# EAGLE design smd_can4vscp_usb_0.0.2 (EAGLE 5.11)
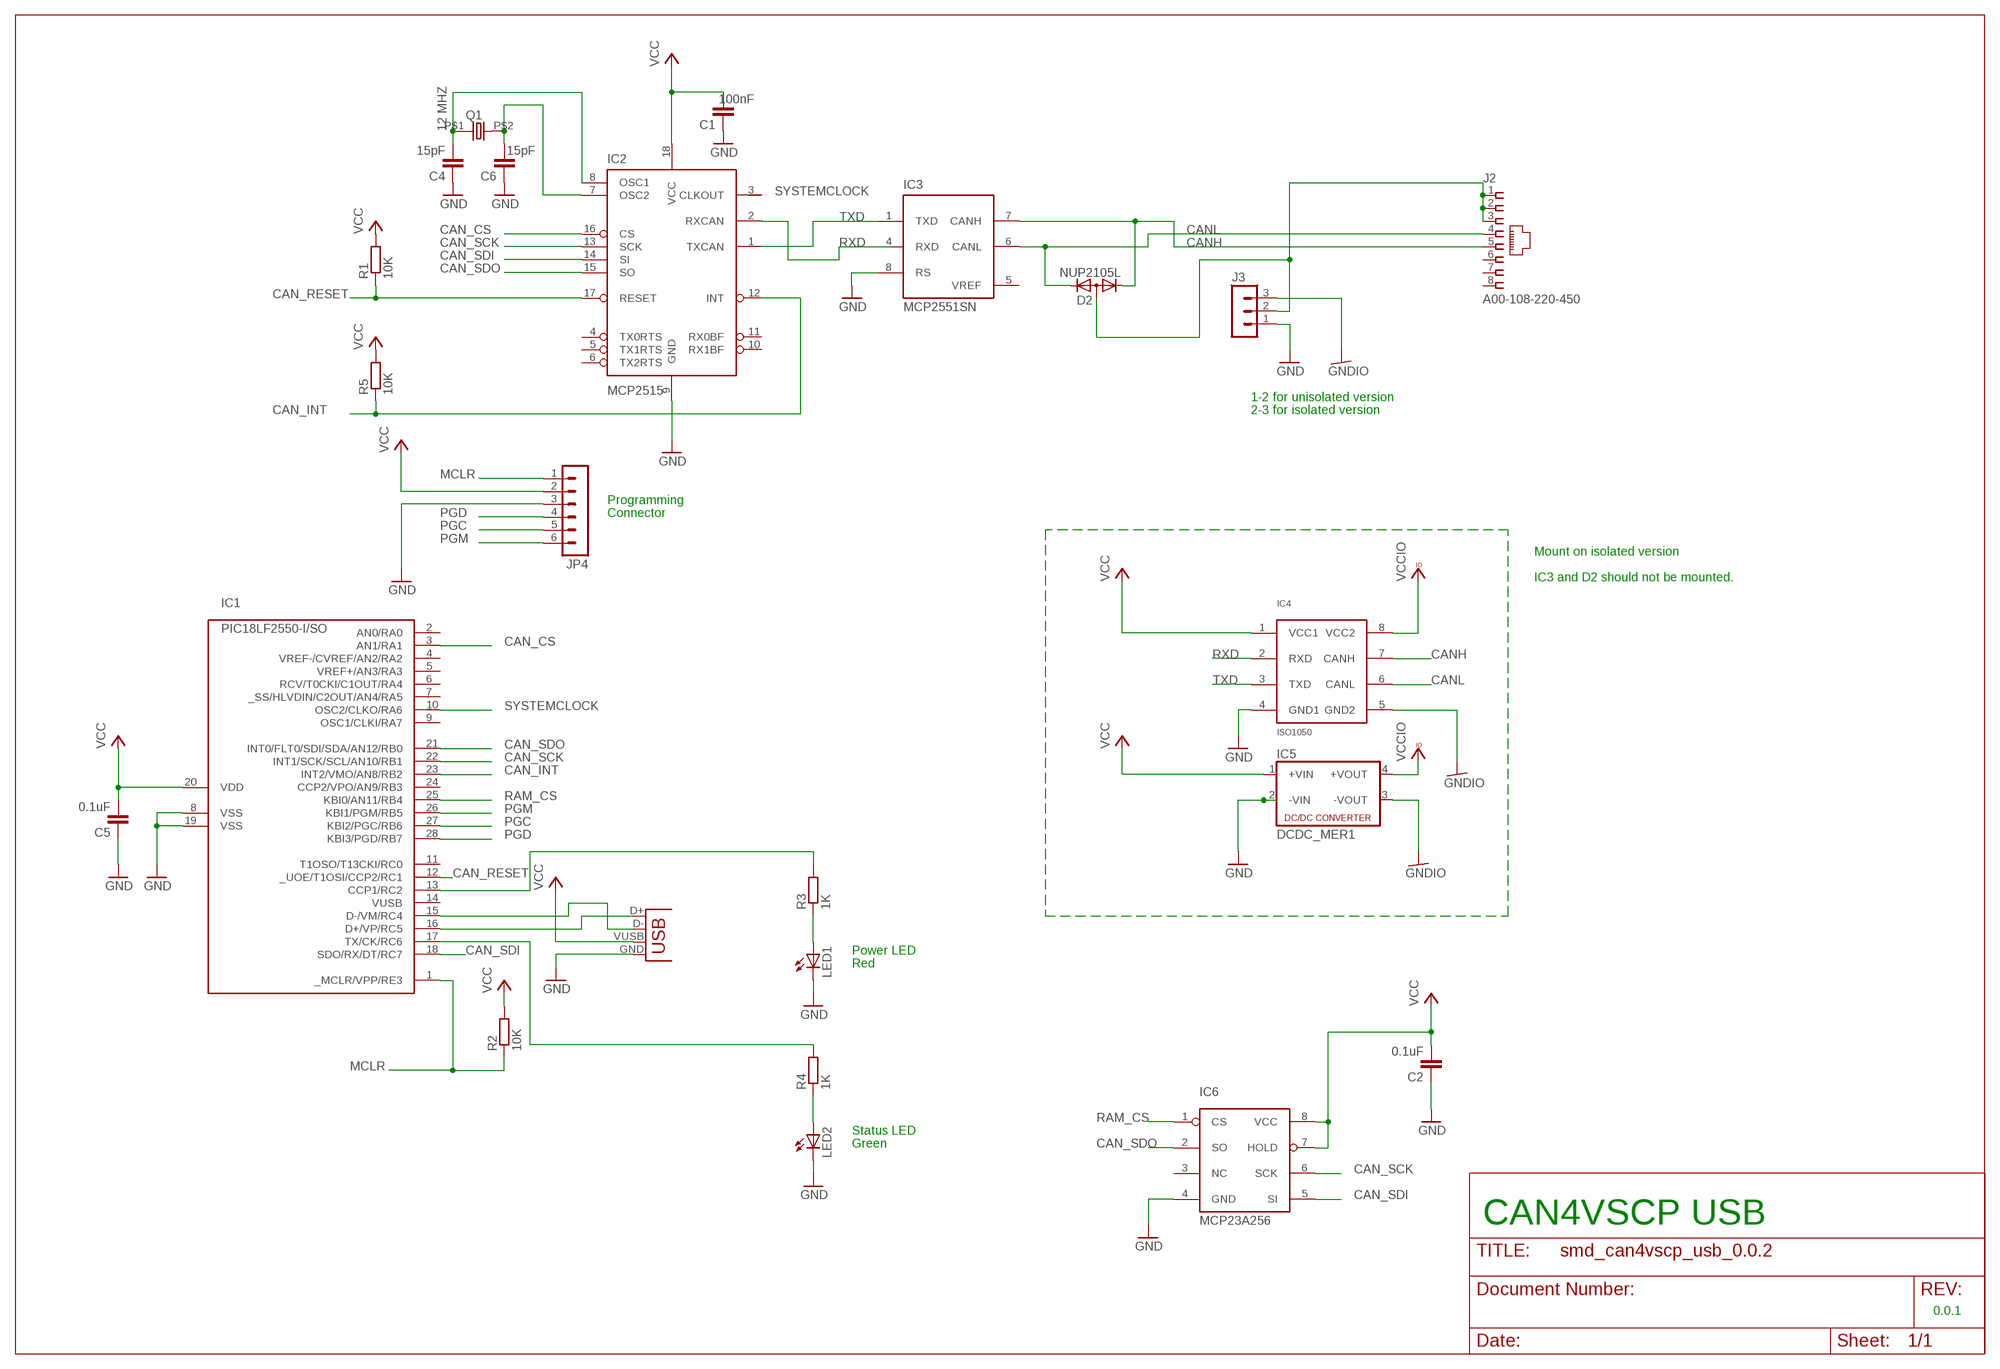
[diagram p0: schematic, sheet 1]

## Parts
C1  100nF  C-EUC0805  [C0805]
C2  0.1uF  C-EUC0805  [C0805]
C4  15pF  C-EUC0805  [C0805]
C5  0.1uF  C-EUC0805  [C0805]
C6  15pF  C-EUC0805  [C0805]
D2  NUP2105L  DIODE-2CA|ACSOT23  [SOT23]
IC1  PIC18LF2550-I/SO  [SO-28W]
IC2  MCP2515  [SO-18W]
IC3  MCP2551SN  [SO-08]
IC4  ISO1050  [DUB_PSOP]
IC5  DCDC_MER1  [MER1]
IC6  MCP23A256  [SO-8]
J2  A00-108-220-450  [RJ-45]
J3  MA03-1  [MA03-1]
J4  USB-B-S  [USB-B-SMT]
JP4  MA06-1  [MA06-1]
LED1  LEDCHIP-LED0805  [CHIP-LED0805]
LED2  LEDCHIP-LED0805  [CHIP-LED0805]
Q1  12 MHZ  HC-49S  [9C]
R1  10K  R-EU_R0805  [R0805]
R2  10K  R-EU_R0805  [R0805]
R3  1K  R-EU_R0805  [R0805]
R4  1K  R-EU_R0805  [R0805]
R5  10K  R-EU_R0805  [R0805]

## Nets
CAN_CS: IC1.3(AN1/RA1) IC2.16(CS)
CAN_INT: IC1.23(INT2/VMO/AN8/RB2) IC2.12(INT) R5.1
CAN_RESET: IC1.12(_UOE/T1OSI/CCP2/RC1) IC2.17(RESET) R1.1
CAN_SCK: IC1.22(INT1/SCK/SCL/AN10/RB1) IC2.13(SCK) IC6.6(SCK)
CAN_SDI: IC1.18(SDO/RX/DT/RC7) IC2.14(SI) IC6.5(SI)
CAN_SDO: IC1.21(INT0/FLT0/SDI/SDA/AN12/RB0) IC2.15(SO) IC6.2(SO)
CANH: D2.1(K1) IC3.7(CANH) IC4.7(CANH) J2.5
CANL: D2.2(K2) IC3.6(CANL) IC4.6(CANL) J2.4
GND: C1.1 C2.1 C4.1 C5.1 C6.1 IC1.8(VSS) IC1.19(VSS) IC2.9(GND) IC3.8(RS) IC4.4(GND1) IC5.2(-VIN) IC6.4(GND) J3.1 J4.GND JP4.3 LED1.C LED2.C
GNDIO: IC4.5(GND2) IC5.3(-VOUT) J3.3
MCLR: IC1.1(_MCLR/VPP/RE3) JP4.1 R2.1
N$1: IC1.16(D+/VP/RC5) J4.D+
N$2: C4.2 IC2.8(OSC1) Q1.P$1
N$3: IC1.15(D-/VM/RC4) J4.D-
N$4: LED2.A R4.1
N$5: LED1.A R3.1
N$6: IC1.13(CCP1/RC2) R3.2
N$7: C6.2 IC2.7(OSC2) Q1.P$2
N$9: D2.3(A) J2.1 J2.2 J2.3 J3.2
N$10: IC1.17(TX/CK/RC6) R4.2
PGC: IC1.27(KBI2/PGC/RB6) JP4.5
PGD: IC1.28(KBI3/PGD/RB7) JP4.4
PGM: IC1.26(KBI1/PGM/RB5) JP4.6
RAM_CS: IC1.25(KBI0/AN11/RB4) IC6.1(CS)
RXD: IC2.2(RXCAN) IC4.2(RXD)
SYSTEMCLOCK: IC1.10(OSC2/CLKO/RA6) IC2.3(CLKOUT)
TXD: IC2.1(TXCAN) IC3.1(TXD) IC4.3(TXD)
VCC: C1.2 C2.2 C5.2 IC1.20(VDD) IC2.18(VCC) IC4.1(VCC1) IC5.1(+VIN) IC6.7(HOLD) IC6.8(VCC) J4.VUSB(VBUS) JP4.2 R1.2 R2.2 R5.2
VCCIO: IC4.8(VCC2) IC5.4(+VOUT)
Unconnected: IC1.2(AN0/RA0) IC1.4(VREF-/CVREF/AN2/RA2) IC1.5(VREF+/AN3/RA3) IC1.6(RCV/T0CKI/C1OUT/RA4) IC1.7(_SS/HLVDIN/C2OUT/AN4/RA5) IC1.9(OSC1/CLKI/RA7) IC1.11(T1OSO/T13CKI/RC0) IC1.14(VUSB) IC1.24(CCP2/VPO/AN9/RB3) IC2.4(TX0RTS) IC2.5(TX1RTS) IC2.6(TX2RTS) IC2.10(RX1BF) IC2.11(RX0BF) IC3.4(RXD) IC6.3(NC) J2.6 J2.7 J2.8

## Notes on the sheet
- 1-2 for unisolated version
- 2-3 for isolated version
- Programming
- Connector
- Mount on isolated version
- IC3 and D2 should not be mounted.
- Power LED
- Red
- Status LED
- Green
- CAN4VSCP USB
- 0.0.1

## Power pins joined to a net without a drawn wire
GND: IC3.2(VSS)
VCC: IC3.3(VDD)
VREF: IC3.5(VREF)

## Library data of the parts
C1 C2 C4-C6 = rcl:C-EU: CAPACITOR, European symbol
D2 = diode:DIODE-2CA|AC: Dual DIODE Cathode-Anode|Anode-Cathode
IC1 = microchip-pic18fxx5x:PIC18*2550: PIC18*2550 Microchip FLASH Microcontroller with FS-USB DEVICE FEATURES Feature PIC18*2550 Program Memory (bytes) 32k Program Memory (instructions) 16384 I/O Ports Ports A, B, C, (E) Capture/Compare/PWM Modules 2 Enhanced Capture/Compare/PWM Modules 0 Parallel Communications (PSP) No 10-bit Analog-to-Digital Module 10 input Channels Package Types 28-pin PDIP 28-pin SOIC NOTES: F only after 18, means standard voltage range from 4.2v to 5.5v LF after 18, means extended voltage range from 2.0v to 5.5v T after entire device number, means supplied in tape and reel TQFP packages only -E before / denotes extended temperature range from -40°C to +120°C -I before / denotes industrial temperature range from -40°C to +85°C /PT suffix denotes TQFP package /SO suffix denotes SOIC package /SP suffix denotes Skinny Plastic DIP package /P suffix denotes Plastic DIP package /ML suffix denotes QFN package
IC2 = vscpcan:MCP2515
IC3 = microchip_can:MCP2551: High Speed CAN tranceiver
IC4 = vscpcan:ISO1050
IC5 = vscpcan:DCDC_MER1
IC6 = vscpcan:MCP23A256
J2 = vscpcan:A00-108-220-450
J3 = con-lstb:MA03-1: PIN HEADER; OC_FARNELL: unknown; OC_NEWARK: unknown
J4 = con-usb:USB: USB Connectors
JP4 = con-lstb:MA06-1: PIN HEADER; OC_FARNELL: unknown; OC_NEWARK: unknown
LED1 LED2 = led:LED: LED OSRAM: - CHIPLED LG R971, LG N971, LY N971, LG Q971, LY Q971, LO R971, LY R971 LH N974, LH R974 LS Q976, LO Q976, LY Q976 LO Q996 - Hyper CHIPLED LW Q18S LB Q993, LB Q99A, LB R99A - SideLED LS A670, LO A670, LY A670, LG A670, LP A670 LB A673, LV A673, LT A673, LW A673 LH A674 LY A675 LS A676, LA A676, LO A676, LY A676, LW A676 LS A679, LY A679, LG A679 - Hyper Micro SIDELED® LS Y876, LA Y876, LO Y876, LY Y876 LT Y87S - SmartLED LW L88C, LW L88S LB L89C, LB L89S, LG L890 LS L89K, LO L89K, LY L89K LS L896, LA L896, LO L896, LY L896 - TOPLED LS T670, LO T670, LY T670, LG T670, LP T670 LSG T670, LSP T670, LSY T670, LOP T670, LYG T670 LG T671, LOG T671, LSG T671 LB T673, LV T673, LT T673, LW T673 LH T674 LS T676, LA T676, LO T676, LY T676, LB T676, LH T676, LSB T676, LW T676 LB T67C, LV T67C, LT T67C, LS T67K, LO T67K, LY T67K, LW E67C LS E67B, LA E67B, LO E67B, LY E67B, LB E67C, LV E67C, LT E67C LW T67C LS T679, LY T679, LG T679 LS T770, LO T770, LY T770, LG T770, LP T770 LB T773, LV T773, LT T773, LW T773 LH T774 LS E675, LA E675, LY E675, LS T675 LS T776, LA T776, LO T776, LY T776, LB T776 LHGB T686 LT T68C, LB T68C - Hyper Mini TOPLED® LB M676 - Mini TOPLED Santana® LG M470 LS M47K, LO M47K, LY M47K Source: http://www.osram.convergy.de LUXEON: - LUMILED® LXK2-PW12-R00, LXK2-PW12-S00, LXK2-PW14-U00, LXK2-PW14-V00 LXK2-PM12-R00, LXK2-PM12-S00, LXK2-PM14-U00 LXK2-PE12-Q00, LXK2-PE12-R00, LXK2-PE12-S00, LXK2-PE14-T00, LXK2-PE14-U00 LXK2-PB12-K00, LXK2-PB12-L00, LXK2-PB12-M00, LXK2-PB14-N00, LXK2-PB14-P00, LXK2-PB14-Q00 LXK2-PR12-L00, LXK2-PR12-M00, LXK2-PR14-Q00, LXK2-PR14-R00 LXK2-PD12-Q00, LXK2-PD12-R00, LXK2-PD12-S00 LXK2-PH12-R00, LXK2-PH12-S00 LXK2-PL12-P00, LXK2-PL12-Q00, LXK2-PL12-R00 Source: www.luxeon.com KINGBRIGHT: KA-3528ASYC Source: www.kingbright.com
Q1 = vscpcan:HC-49S: Digikey 887-1050-1-nd
R1-R5 = rcl:R-EU_: RESISTOR, European symbol

## Board
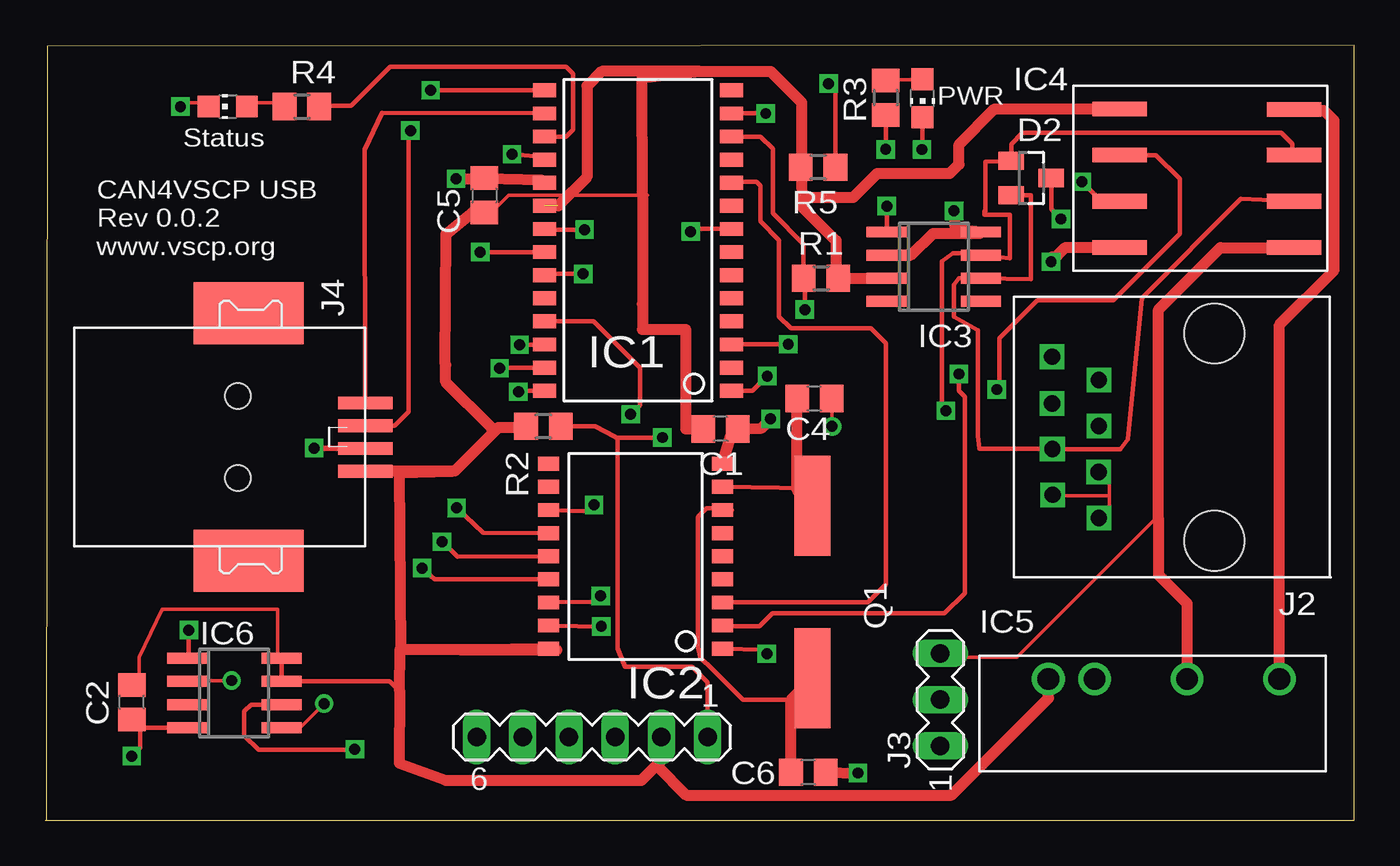
[diagram p1: board, top side]
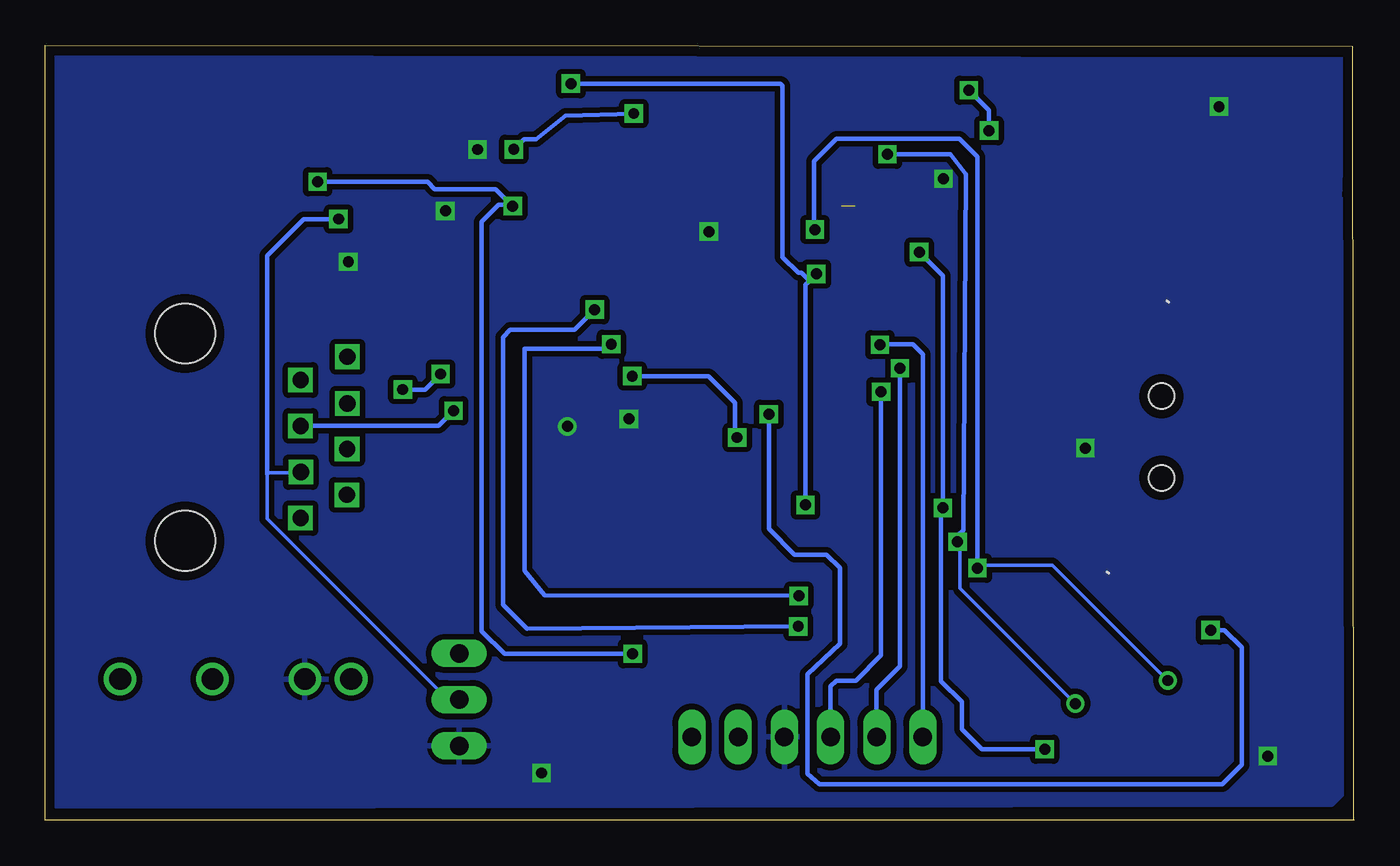
[diagram p2: board, bottom side, seen from below]

Size 71.96 x 42.58 mm. Coordinates in mm from the lower left corner, seen from the top.
Outline: 0,0 71.96,0 71.96,42.58 0.09,42.53 0.04,0.01
Copper layers (1*16): Top 0.035mm / dielectric 1.5mm / Bottom 0.035mm
Design rules "8mils": minimum track width 8mil, minimum drill 0.6mm, track to track 8mil, track to pad 8mil, pad to pad 8mil, via to via 8mil, smd to smd 0mil, copper to edge 20mil, drill to drill 10mil, minimum pad ring 8mil, minimum via ring 8mil, stop-mask expansion 0mil, vias tented up to drill 0mil, thermal gap 10mil

### Footprints (pad centres in the part's own frame; a part is rotated, then mirrored left to right if it is on the bottom)
C0805 = smd 1.3 x 1.5: 1 -0.95,0; 2 0.95,0
SOT23 = smd 1 x 1.4: 1 -0.95,-1.1; 2 0.95,-1.1; 3 0,1.1
SO-28W = smd 0.762 x 1.27: 1 -7.62,-5.207; 2 -6.35,-5.207; 3 -5.08,-5.207; 4 -3.81,-5.207; 5 -2.54,-5.207; 6 -1.27,-5.207; 7 0,-5.207; 8 1.27,-5.207; 9 2.54,-5.207; 10 3.81,-5.207; 11 5.08,-5.207; 12 6.35,-5.207; 13 7.62,-5.207; 14 8.89,-5.207; 15 8.89,5.08; 16 7.62,5.08; 17 6.35,5.08; 18 5.08,5.08; 19 3.81,5.08; 20 2.54,5.08; 21 1.27,5.08; 22 0,5.08; 23 -1.27,5.08; 24 -2.54,5.08; 25 -3.81,5.08; 26 -5.08,5.08; 27 -6.35,5.08; 28 -7.62,5.08
SO-18W = smd 0.762 x 1.143: 1 -5.08,-4.788; 2 -3.81,-4.788; 3 -2.54,-4.788; 4 -1.27,-4.788; 5 0,-4.788; 6 1.27,-4.788; 7 2.54,-4.788; 8 3.81,-4.788; 9 5.08,-4.788; 10 5.08,4.788; 11 3.81,4.788; 12 2.54,4.788; 13 1.27,4.788; 14 0,4.788; 15 -1.27,4.788; 16 -2.54,4.788; 17 -3.81,4.788; 18 -5.08,4.788
SO-08 = smd 0.6 x 2.2: 1 -1.905,-2.6; 2 -0.635,-2.6; 3 0.635,-2.6; 4 1.905,-2.6; 5 1.905,2.6; 6 0.635,2.6; 7 -0.635,2.6; 8 -1.905,2.6
DUB_PSOP = smd 0.8 x 3: 1 -2.54,0; 2 0,0; 3 2.54,0; 4 5.08,0; 5 5.08,9.6; 6 2.54,9.6; 7 0,9.6; 8 -2.5,9.6
MER1 = drill 1.2 round: 1 -5.08,0; 2 -2.54,0; 3 2.54,0; 4 7.62,0
SO-8 = smd 0.6 x 2.2: 1 -1.905,-2.6; 2 -0.635,-2.6; 3 0.635,-2.6; 4 1.905,-2.6; 5 1.905,2.6; 6 0.635,2.6; 7 -0.635,2.6; 8 -1.905,2.6
RJ-45 = drill 0.9 square: 1 -4.45,6.35; 2 -3.17,8.89; 3 -1.92,6.36; 4 -0.65,8.91; 5 0.62,6.35; 6 1.84,8.93; 7 3.14,6.35; 8 4.42,8.93 | hole 3.3: -5.7,0; 5.7,0
MA03-1 = drill 1.016 long: 1 -2.54,0; 2 0,0; 3 2.54,0
USB-B-SMT = smd 6.04 x 3.4: 5 0.58,6.8; 6 0.58,-6.8 | smd 3 x 0.7: D+ 7,1.875; D- 7,0.625; GND 7,-0.625; VUSB 7,-1.875 | hole 1.4: 0,2.25; 0,-2.25
MA06-1 = drill 1.016 long: 1 -6.35,0; 2 -3.81,0; 3 -1.27,0; 4 1.27,0; 5 3.81,0; 6 6.35,0
CHIP-LED0805 = smd 1.2 x 1.2: A 0,-1.05; C 0,1.05
9C = smd 5.5 x 2: P$1 -4.74,0; P$2 4.76,0
R0805 = smd 1.3 x 1.5: 1 -0.95,0; 2 0.95,0

### Placement (x,y rotation side)
C1  37.13,21.5 180 top
C2  4.75,6.48 90 top
C4  42.28,23.17 180 top
C5  24.14,34.34 270 top
C6  41.95,2.63 180 top
D2  54.21,35.29 270 top
IC1  32.52,31.22 90 top
IC2  32.45,14.5 90 top
IC3  48.85,30.42 270 top
IC4  59.06,36.56 270 top
IC5  60.24,7.75 0 top
IC6  10.38,6.99 270 top
J2  64.28,21.05 90 top
J3  49.21,6.62 90 top
J4  10.59,21.06 0 top
JP4  30.06,4.57 180 top
LED1  48.23,39.68 180 top
LED2  10.03,39.22 90 top
Q1  42.18,12.55 270 top
R1  42.65,29.79 0 top
R2  27.38,21.64 180 top
R3  46.2,39.71 270 top
R4  14.1,39.22 0 top
R5  42.49,35.89 180 top

### Tracks (layer width: path | path; a pad name or v marks a point on that pad's centre or on a via)
CAN_CS  (via drill 0.6)
  Top 0.254: IC2.16 30.11,11.99 v30.53,12.32 | v40.84,26.16 37.74,26.16 IC1.3
  Bottom 0.254: v30.53,12.32 44.5,12.35 45.62,13.69 45.62,25.34 45.61,25.9 41.11,25.9 v40.84,26.16
CAN_INT  (via drill 0.6)
  Top 0.254: IC2.12 29.82,16.98 v30.17,17.32 | v29.57,30.02 27.5,30.02 IC1.23 | R5.1 43.44,40.11 v43.06,40.48
  Bottom 0.254: v30.17,17.32 30.17,29.42 29.95,29.64 | 29.95,29.64 v29.57,30.02 | v43.06,40.48 31.53,40.48 31.42,40.37 31.42,30.95 30.55,30.07 30.39,30.07 29.95,29.64
CAN_RESET  (via drill 0.6)
  Top 0.254: IC1.12 39.31,37.57 40,36.89 40,33.36 41.69,31.66 R1.1 41.76,29.73 v41.76,28.06 | IC2.17 30.86,10.63 v30.56,10.65
  Bottom 0.254: v30.56,10.65 45.48,10.52 46.79,11.83 46.79,26.55 46.4,26.95 42.87,26.95 v41.76,28.06
CAN_SCK  (via drill 0.6)
  Top 0.254: IC2.13 24.06,15.78 v22.6,17.16 | v23.91,31.22 IC1.22 | IC6.6 11.32,6.35 10.94,5.97 10.94,4.65 11.72,3.86 16.98,3.86 v17.01,3.89
  Bottom 0.254: v23.91,31.22 22.6,29.91 v22.6,17.16 22.71,17.06 22.71,7.64 21.57,6.5 21.57,4.99 20.47,3.89 v17.01,3.89
CAN_SDI  (via drill 0.6)
  Top 0.203: v15.32,6.4 14.05,5.13 IC6.5
  Top 0.254: IC2.14 22.66,14.48 v21.8,15.3 | v25.65,36.6 27.29,36.45 IC1.18
  Bottom 0.203: v15.32,6.4 21.67,12.75 21.67,15.29 v21.8,15.3
  Bottom 0.254: v21.8,15.3 21.8,15.62 21.48,15.94 21.33,35.5 22.19,36.59 25.56,36.59 v25.65,36.6
CAN_SDO  (via drill 0.6)
  Top 0.203: v10.24,7.67 7.7,7.67 IC6.2
  Top 0.254: IC2.15 21.39,13.24 v20.71,13.85 | v29.65,32.46 27.47,32.46 IC1.21
  Bottom 0.203: v10.24,7.67 16.59,14.02 20.4,14.02 v20.71,13.85
  Bottom 0.254: v20.71,13.85 20.71,36.45 21.71,37.45 28.47,37.45 29.69,36.23 29.69,32.5 v29.65,32.46
CANH  (via drill 0.6)
  Top 0.254: v49.52,22.5 49.3,22.5 49.3,26.03 49.29,30.71 49.9,31.16 51.35,31.16 IC3.7 53,30.87 53.05,30.87 53.05,33.28 51.64,33.28 51.64,33.46 51.68,33.46 51.68,36.18 D2.1 53.11,37.16 53.73,37.77 67.96,37.77 68.55,37.18 68.55,36.66 IC4.7
  Bottom 0.254: J2.5 50.35,21.67 v49.52,22.5
CANL
  Top 0.254: D2.2 54.18,34.34 54.18,32.32 54.18,29.74 IC3.6 50.24,29.77 49.95,29.43 49.95,27.66 51.28,26.93 51.28,21.13 51.37,20.4 J2.4 55.52,20.39 59.12,20.39 59.53,20.93 60.28,28.68 65.75,34.14 IC4.6
GND  (via drill 0.6)
  Top 0.203: LED2.C 8.97,39.42 7.7,39.42 v7.42,39.22 | v43.26,21.64 43.26,22.91 C4.1
  Top 0.254: IC1.8 35.62,32.49 v35.48,32.35 | LED1.C 48.23,36.9 v48.19,36.86 | 5.2,5.08 IC6.4 | 5.2,5.08 C2.1 | 5.2,5.08 5.2,3.98 v4.74,3.51 | IC3.2 47.6,31.05 48.65,32.1 49.78,32.1 50.1,32.41 50.1,33.55 50.05,33.59
  Top 0.305: J4.GND 14.8,20.43 v14.78,20.45
  Top 0.61: v22.58,35.25 24.23,35.25 C5.1 27.28,35.19 IC1.19 | C6.1 v44.67,2.58 v44.68,2.59 | v39.88,22.05 39.38,21.55 C1.1 37.69,21.12 IC2.9 | v49.96,33.49 50.04,32.48 IC3.8 51.38,32.26 48.83,32.26 47.58,31.05 IC3.2 | 55.35,30.95 v55.3,30.69 56.09,31.48 IC4.4
  pour Bottom (isolate 0.305): 0.67,34.09 0.67,1.45 1.26,0.86 71.35,0.76 71.52,1.63 71.65,34.23 71.74,41.91 0.54,41.79 0.82,34.17
GNDIO
  Top 0.203: J3.3 49.61,8.94 53.42,8.94 61.04,16.56 61.21,16.56
  Top 0.61: IC5.3 62.78,11.92 61.21,13.49 61.21,16.56 61.21,28.06 64.61,31.46 68.64,31.46 IC4.5
MCLR  (via drill 0.6)
  Top 0.254: JP4.1 36.41,7.56 35.55,8.43 31.86,8.43 31.44,9.43 31.44,21.02 31.33,21.08 | 31.33,21.08 30.23,21.65 R2.1 | IC1.1 38.89,23.6 v39.69,24.41 | v33.92,21.03 31.38,21.03 31.33,21.08
  Bottom 0.254: v39.69,24.41 35.5,24.41 34.03,22.94 34.03,21.14 v33.92,21.03
N$1
  Top 0.254: J4.D+ 17.55,36.86 18.52,38.89 IC1.16
N$2
  Top 0.254: IC2.8 41.94,18.25 42.43,17.75 42.18,17.5 Q1.P$1
  Top 0.61: C4.2 41.33,18.14 Q1.P$1
N$3  (via drill 0.6)
  Top 0.254: J4.D- 19.21,21.68 19.98,22.45 19.98,37.81 v20.07,37.9 | 27.47,40.15 IC1.15 v21.18,40.12
  Bottom 0.254: v20.07,37.9 20.07,39.01 v21.18,40.12
N$4
  Top 0.203: LED2.A 11.51,39.42 12.78,39.42 R4.1
N$5
  Top 0.203: LED1.A 48.34,40.69 45.8,40.69 R3.1
N$6  (via drill 0.6)
  Top 0.254: IC1.13 v39.6,38.84 v39.61,38.84 | v46.2,36.87 R3.2
  Bottom 0.254: v39.61,38.84 43.37,38.71 44.97,37.43 45.64,37.43 v46.2,36.87
N$7
  Top 0.254: 37.74,17.03 IC2.7 37.14,17.14 36.34,17.14 35.89,16.68 35.89,9.5 36.02,8.89 36.46,8.52 38.36,6.61 41,6.61
  Top 0.61: C6.2 41,6.61 Q1.P$2
N$9  (via drill 0.6)
  Top 0.203: 58.5,17.83 55.96,17.83 J2.2 | 58.5,17.83 58.5,19.1 J2.3 | 58.5,17.83 58.5,16.56 J2.1
  Top 0.254: D2.3 55.31,33.57 v55.84,33.04
  Bottom 0.203: J3.2 49.61,6.4 59.77,16.56 59.77,19.02 59.77,19.1 58.5,19.1 J2.3
  Bottom 0.254: v55.84,33.04 57.76,33.04 59.78,31.02 59.78,19.03 59.77,19.02
N$10
  Top 0.254: IC1.17 28.62,37.57 29,37.95 29,41.04 28.64,41.4 18.94,41.4 16.81,39.27 15.1,39.27 R4.2
PGC  (via drill 0.6)
  Top 0.254: IC1.27 25.01,24.87 v24.97,24.83
  Bottom 0.254: v24.97,24.83 24.97,8.46 26.26,7.17 26.26,4.58 JP4.5
PGD  (via drill 0.6)
  Top 0.254: IC1.28 26.07,23.6 v26.01,23.54
  Bottom 0.254: v26.01,23.54 26.01,9.06 27.4,7.67 28.47,7.67 28.78,7.36 JP4.4
PGM  (via drill 0.6)
  Top 0.254: v26.07,26.12 27.42,26.12 IC1.26
  Bottom 0.254: JP4.6 23.71,25.62 24.25,26.16 26.04,26.16 v26.07,26.12
RAM_CS  (via drill 0.6)
  Top 0.254: IC1.25 30.13,27.41 32.68,24.86 32.68,22.82 v32.18,22.31 | v7.88,10.44 7.88,8.99 IC6.1
  Bottom 0.254: v32.18,22.31 32.18,16.01 30.76,14.6 29,14.6 28.28,13.87 28.28,9.68 30.05,8.01 30.05,2.56 29.41,1.97 7.26,1.97 6.19,3.04 6.19,9.5 7.13,10.44 v7.88,10.44
RXD  (via drill 0.6)
  Top 0.254: IC4.2 61.06,36.56 62.37,35.25 62.37,32.23 58.72,28.57 54.54,28.57 52.45,26.48 52.45,23.99 v52.31,23.67 | v50.23,24.52 50.23,23.6 50.55,23.28 50.55,12.48 49.45,11.37 39.98,11.37 39.26,10.65 37.28,10.65 IC2.2
  Bottom 0.254: v52.31,23.67 51.08,23.67 v50.23,24.52
SYSTEMCLOCK
  Top 0.254: IC2.3 45.22,11.96 46.22,12.96 46.22,26.21 45.4,27.02 41,27.02 40.34,27.68 40.34,31.88 39.31,32.91 39.31,34.87 39.09,35.09 37.78,35.09 IC1.10
TXD  (via drill 0.6)
  Top 0.254: IC2.1 39.46,9.36 v39.67,9.15 | v46.27,33.75 46.27,32.34 IC3.1 | IC4.3 58.06,34.02 v56.99,35.09
  Bottom 0.254: v39.67,9.15 46.72,9.15 47.97,10.39 47.97,32.9 47.05,33.82 46.33,33.82 v46.27,33.75 47.2,34.68 50.55,34.68 50.96,35.09 v56.99,35.09
VCC  (1 unrouted)
  Top 0.203: C2.2 5.16,7.67 5.16,8.94 6.43,11.6 12.78,11.6 12.78,8.94 IC6.8 | 32.82,34.34 33.1,34.34 25.48,34.34 24.21,33.07 C5.2
  Top 0.254: 22.41,19.18 22.5,19.18 | 26.38,21.59 R2.2 | 24.91,21.59 24.5,21.59 | 22.01,25.02 21.98,25.05 | IC6.8 IC6.7 18.94,7.62 19.49,7.07
  Top 0.61: J4.VUSB 22.41,19.18 19.48,19.08 19.55,9.37 23.48,9.36 IC2.18 28.11,9.36 22.84,9.36 19.51,9.43 19.49,7.07 19.45,3.13 22.03,2.18 32.77,2.18 33.59,3 | 24.47,33.76 C5.2 23.72,33.59 22.02,32.22 21.98,25.05 | 28.19,33.76 29.78,35.35 29.78,40.35 30.58,41.15 35.99,41.15 | 35.99,41.15 39.88,41.15 41.58,39.45 41.58,35.94 R5.2 41.61,34.25 | 41.61,34.25 41.64,33.69 43.48,31.85 43.48,29.81 R1.2 IC3.3 | 22.5,19.18 24.91,21.59 26.38,21.59 | 24.5,21.59 22.01,24.08 22.01,25.02 | JP4.2 33.87,3.28 33.59,3 | C1.2 35.21,21.5 35.21,26.98 32.83,26.98 32.83,28.38 32.82,34.34 32.81,40.81 35.99,41.15 | IC5.1 55.16,6.7 49.82,1.37 35.23,1.37 33.59,3 | IC4.1 52.2,39.1 50.23,37.13 50.23,36.04 49.73,35.55 45.74,35.55 44.43,34.23 41.63,34.23 41.61,34.25
VCCIO
  Top 0.61: IC5.4 67.86,27.23 70.87,30.24 70.87,38.45 70.32,39 68.72,39 IC4.8

### Text on the board
tPlace: PWR | Status
tNames: CAN4VSCP USB | Rev 0.0.2 | www.vscp.org